# Altium schematic sheet LevelShifter.SchDoc
size A
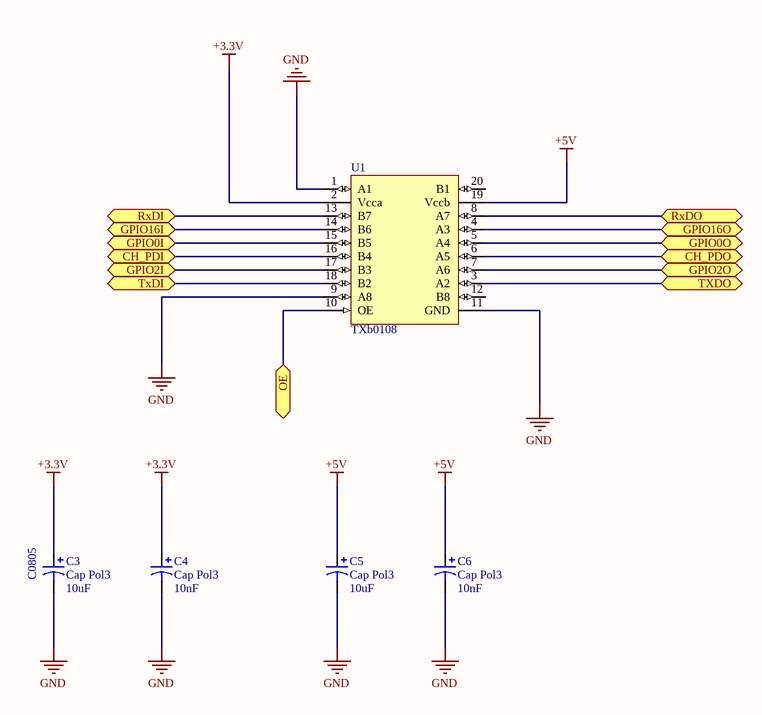
[diagram p0: LevelShifter.SchDoc]

## Parts
C3  Cap Pol3  value 10uF  [C0805]
C4  Cap Pol3  value 10nF  [C0805]
C5  Cap Pol3  value 10uF  [C0805]
C6  Cap Pol3  value 10nF  [C0805]
U1  TXb0108  [TXB0108]

## Ports
CH_PDI, CH_PDO, GPIO0I, GPIO0O, GPIO2I, GPIO2O, GPIO16I, GPIO16O, OE, RxDI, RxDO, TxDI, TXDO

## Nets
+3.3V: C3.1 C4.1 U1.2(Vcca)
+5V: C5.1 C6.1 U1.19(Vccb)
GND: C3.2 C4.2 C5.2 C6.2 U1.1(A1) U1.9(A8) U1.11(GND)
CH_PDI: U1.16(B4) ; port CH_PDI
CH_PDO: U1.6(A5) ; port CH_PDO
GPIO0I: U1.15(B5) ; port GPIO0I
GPIO0O: U1.5(A4) ; port GPIO0O
GPIO2I: U1.17(B3) ; port GPIO2I
GPIO2O: U1.7(A6) ; port GPIO2O
GPIO16I: U1.14(B6) ; port GPIO16I
GPIO16O: U1.4(A3) ; port GPIO16O
OE: U1.10(OE) ; port OE
RxDI: U1.13(B7) ; port RxDI
RxDO: U1.8(A7) ; port RxDO
TxDI: U1.18(B2) ; port TxDI
TXDO: U1.3(A2) ; port TXDO

Not connected (* = marked no-connect by the designer): U1 12(B8) 20(B1)

## Library data of the parts
C3-C6 = Cap Pol3: Polarized Capacitor (Surface Mount); Published: 8-Jun-2000; LatestRevisionDate: 29-May-2009; LatestRevisionNote: IPC-7351 Footprint Added.; PackageReference: C0805; Publisher: Altium Limited; PackageDescription: Chip Capacitor